# EAGLE design BBB_ADS1271_cape (EAGLE 7.5.0)
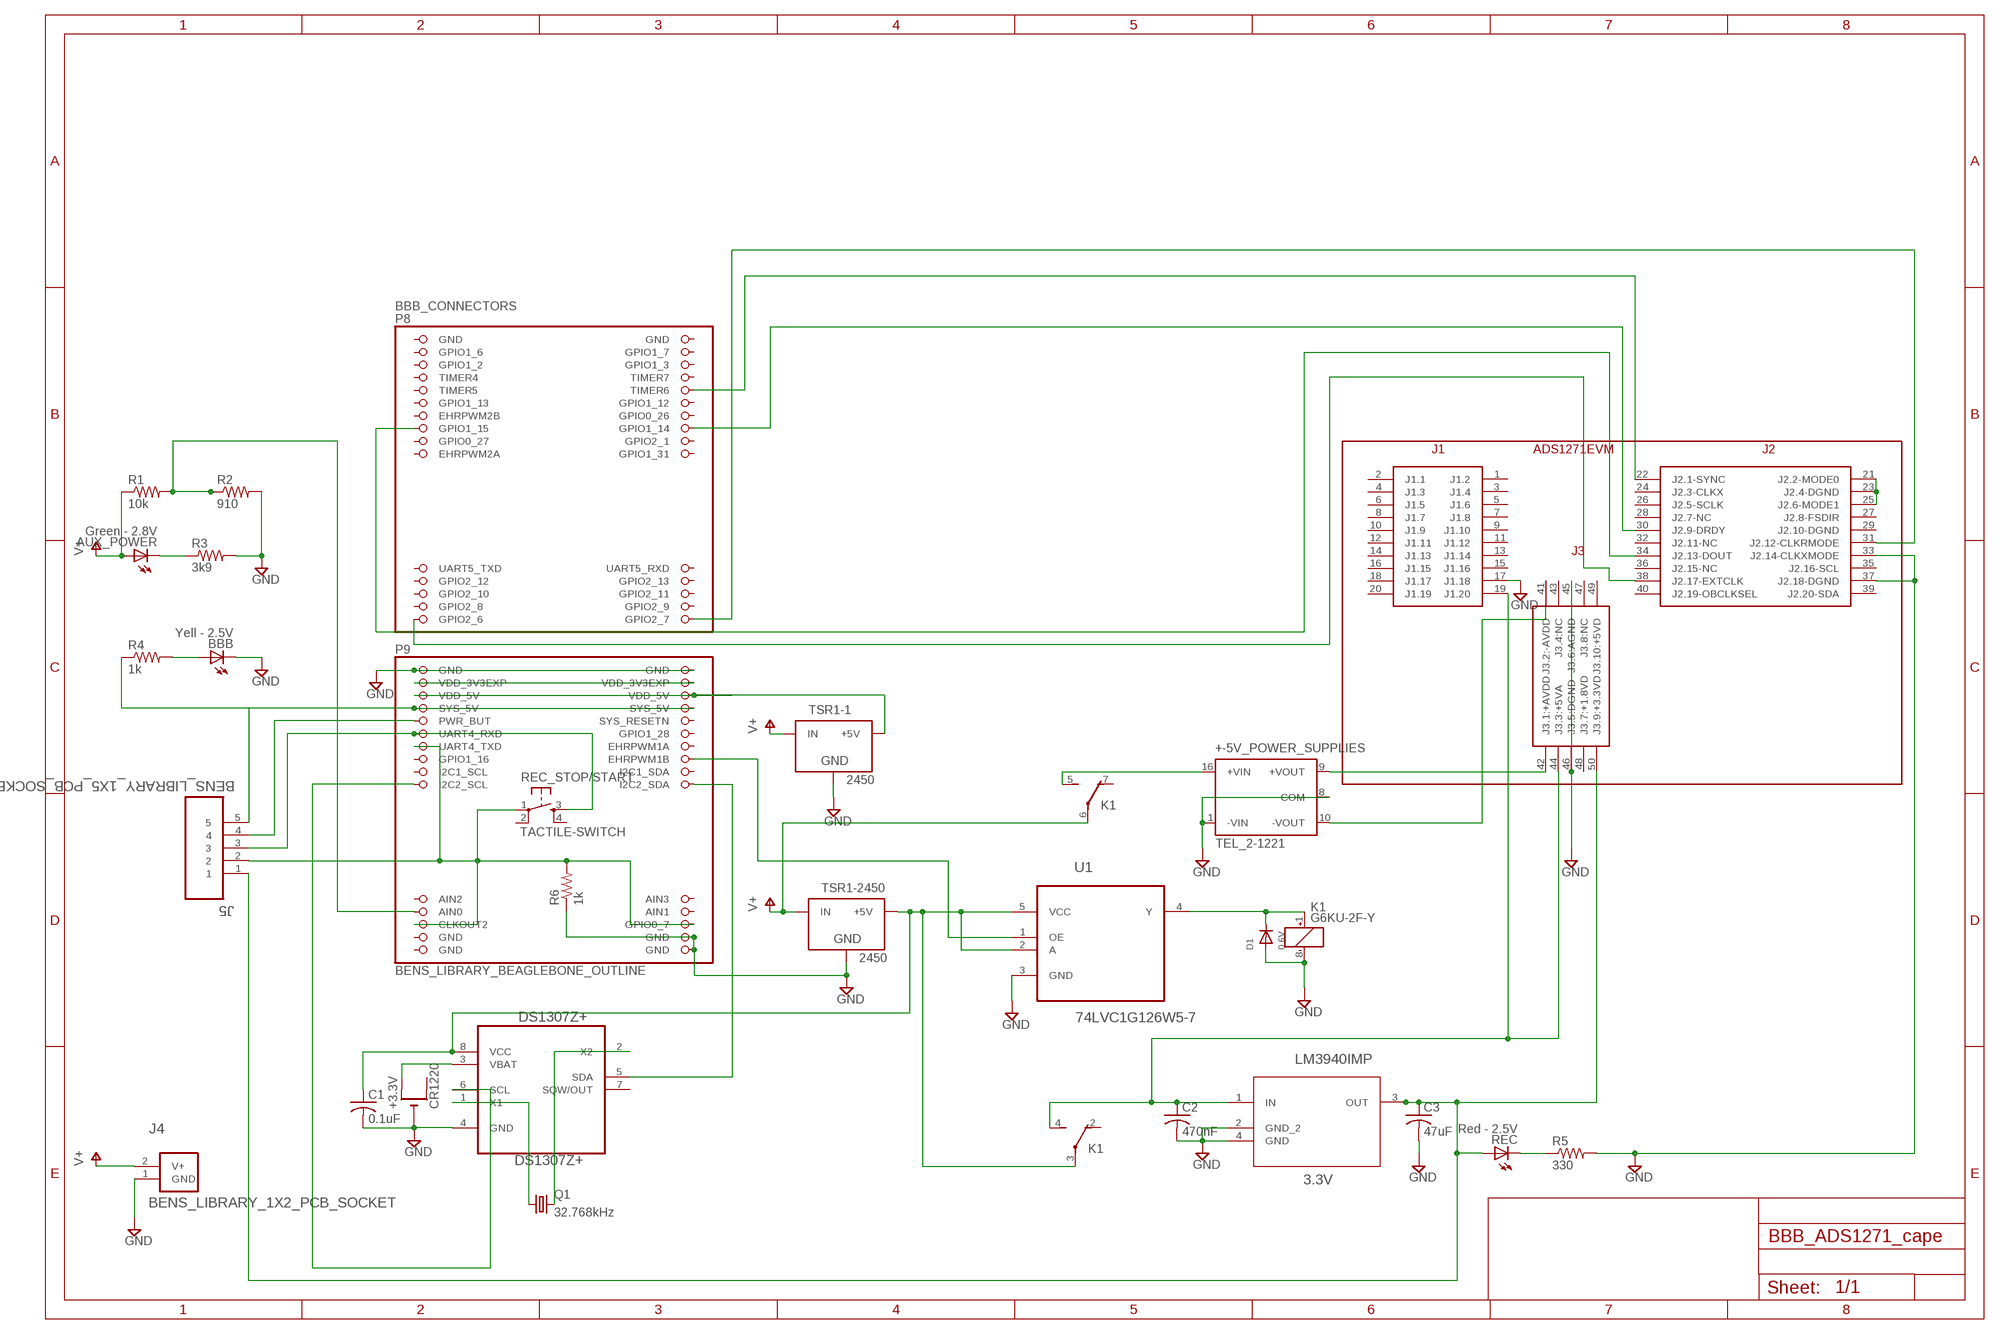
[diagram p0: schematic, sheet 1]

## Parts
+-5V_POWER_SUPPLIES  TEL_2-1221  [TRACOPOWER2W]
ADS1271_CONNECTORS  BENS_LIBRARY_ADS1271EVM  [BENS_LIBRARY_ADS1271EVM]
AUX_POWER  Green - 2.8V  LEDCHIPLED_0805  [CHIPLED_0805]
BBB  Yell - 2.5V  LEDCHIPLED_0805  [CHIPLED_0805]
BBB_CONNECTORS  BENS_LIBRARY_BEAGLEBONE_OUTLINE  [BENS_LIBRARY_BEAGLEBONE_SHIELD]
C1  0.1uF  C-USC0805K  [C0805K]
C2  470nF  C-USC0805K  [C0805K]
C3  47uF  C-USC0805K  [C0805K]
CR1220  +3.3V  ADAFRUIT_CR1220SMT  [ADAFRUIT_CR1220-SMD]
D1  0.6V  DIODE_SOD-123FL  [SOD-123FL]
DS1307Z+  DS1307Z+  [MAXIM_BY_ELEMENT14_BATCH_1_SOIC127P600X175-8N]
J4  BENS_LIBRARY_1X2_PCB_SOCKET  [BENS_LIBRARY_1X2_PCB_SOCKET]
J5  BENS_LIBRARY_1X5_PCB_SOCKET  [BENS_LIBRARY_SAMTEC_SSM-15-L-DV-BE]
K1  G6KU-2F-Y  [G6KU-2F-Y]
LM3940IMP  3.3V  LM3940IMP  [NSC_BY_ELEMENT14_BATCH_1.1_SOT230P696X180-4N]
Q1  32.768kHz  CRYSTALTC38H  [TC38H]
R1  10k  ADAFRUIT_R-US_R0805  [ADAFRUIT_R0805]
R2  910  ADAFRUIT_R-US_R0805  [ADAFRUIT_R0805]
R3  3k9  ADAFRUIT_R-US_R0805  [ADAFRUIT_R0805]
R4  1k  ADAFRUIT_R-US_R0805  [ADAFRUIT_R0805]
R5  330  ADAFRUIT_R-US_R0805  [ADAFRUIT_R0805]
R6  1k  ADAFRUIT_R-US_R0805  [ADAFRUIT_R0805]
REC  Red - 2.5V  LEDCHIPLED_0805  [CHIPLED_0805]
REC_STOP/START  TACTILE-SWITCH  [7914G-6MM]
TSR1-1  2450  TSR1-2450  [STEELCAVEROBOTICS-POWER_TSR-1]
TSR1-2450  2450  TSR1-2450  [STEELCAVEROBOTICS-POWER_TSR-1]
U1  74LVC1G126W5-7  [SOT95P280X145-5N]

## Nets
3.3V_BBB_1: BBB_CONNECTORS.57(UART4_RXD) J5.3 REC_STOP/START.3
3.3V_BBB_2: ADS1271_CONNECTORS.31(J2.12-CLKRMODE) BBB_CONNECTORS.46(GPIO2_7)
3.3V_RELAY: ADS1271_CONNECTORS.50(J3.9:+3.3VD) C3.1 J5.1 LM3940IMP.3(OUT) REC.A
5V: C1.1 DS1307Z+.8(VCC) K1.3(2:P) TSR1-2450.3(+5V) U1.2(A) U1.5(VCC)
5V_BBB: BBB_CONNECTORS.51(VDD_5V) BBB_CONNECTORS.52(VDD_5V) TSR1-1.3(+5V)
5V_RELAY: ADS1271_CONNECTORS.19(J1.20) ADS1271_CONNECTORS.44(J3.3:+5VA) C2.1 K1.4(2:S) LM3940IMP.1(IN)
+5V_OP_AMP: +-5V_POWER_SUPPLIES.9(+VOUT) ADS1271_CONNECTORS.42(J3.1:+AVDD)
-5V_OP_AMP: +-5V_POWER_SUPPLIES.10(-VOUT) ADS1271_CONNECTORS.41(J3.2:-AVDD)
CLK: ADS1271_CONNECTORS.38(J2.17-EXTCLK) BBB_CONNECTORS.45(GPIO2_6)
DGND: ADS1271_CONNECTORS.21(J2.2-MODE0) ADS1271_CONNECTORS.23(J2.4-DGND) ADS1271_CONNECTORS.25(J2.6-MODE1)
DOUT: ADS1271_CONNECTORS.34(J2.13-DOUT) BBB_CONNECTORS.15(GPIO1_15)
DRDY: ADS1271_CONNECTORS.30(J2.9-DRDY) BBB_CONNECTORS.16(GPIO1_14)
GND: +-5V_POWER_SUPPLIES.1(-VIN) +-5V_POWER_SUPPLIES.8(COM) ADS1271_CONNECTORS.17(J1.18) ADS1271_CONNECTORS.33(J2.14-CLKXMODE) ADS1271_CONNECTORS.37(J2.18-DGND) ADS1271_CONNECTORS.45(J3.6:AGND) ADS1271_CONNECTORS.46(J3.5:DGND) BBB.C BBB_CONNECTORS.47(GND) BBB_CONNECTORS.48(GND) BBB_CONNECTORS.90(GND) BBB_CONNECTORS.92(GND) C1.2 C2.2 C3.2 CR1220.- D1.A DS1307Z+.4(GND) J4.1(GND) K1.8(1:-) LM3940IMP.2(GND_2) LM3940IMP.4(GND) R2.2 R3.2 R5.2 R6.1 TSR1-1.2(GND) TSR1-2450.2(GND) U1.3(GND)
N$1: CR1220.+$2(+1) DS1307Z+.3(VBAT)
N$2: +-5V_POWER_SUPPLIES.16(+VIN) K1.5(3:S)
N$8: BBB_CONNECTORS.85(AIN0) R1.2 R2.1
N$10: BBB_CONNECTORS.66(I2C2_SDA) DS1307Z+.5(SDA)
N$11: BBB_CONNECTORS.65(I2C2_SCL) DS1307Z+.6(SCL)
N$12: DS1307Z+.2(X2) Q1.2
N$13: DS1307Z+.1(X1) Q1.1
N$15: AUX_POWER.C R3.1
N$16: D1.C K1.1(1:+) U1.4(Y)
N$18: R5.1 REC.C
N$19: BBB.A R4.2
P8.9: BBB_CONNECTORS.62(EHRPWM1B) U1.1(OE)
PWR_BUT: BBB_CONNECTORS.55(PWR_BUT) J5.4
REC_SWITCH: BBB_CONNECTORS.59(UART4_TXD) BBB_CONNECTORS.87(CLKOUT2) BBB_CONNECTORS.88(GPIO0_7) J5.2 R6.2 REC_STOP/START.1
SYNC: ADS1271_CONNECTORS.22(J2.1-SYNC) BBB_CONNECTORS.10(TIMER6)
SYS_5V: BBB_CONNECTORS.53(SYS_5V) BBB_CONNECTORS.54(SYS_5V) J5.5 R4.1
V+: AUX_POWER.A J4.2(V+) K1.6(3:P) R1.1 TSR1-1.1(IN) TSR1-2450.1(IN)
VDD_3V3EXP: BBB_CONNECTORS.49(VDD_3V3EXP) BBB_CONNECTORS.50(VDD_3V3EXP)
Unconnected: ADS1271_CONNECTORS.1(J1.2) ADS1271_CONNECTORS.2(J1.1) ADS1271_CONNECTORS.3(J1.4) ADS1271_CONNECTORS.4(J1.3) ADS1271_CONNECTORS.5(J1.6) ADS1271_CONNECTORS.6(J1.5) ADS1271_CONNECTORS.7(J1.8) ADS1271_CONNECTORS.8(J1.7) ADS1271_CONNECTORS.9(J1.10) ADS1271_CONNECTORS.10(J1.9) ADS1271_CONNECTORS.11(J1.12) ADS1271_CONNECTORS.12(J1.11) ADS1271_CONNECTORS.13(J1.14) ADS1271_CONNECTORS.14(J1.13) ADS1271_CONNECTORS.15(J1.16) ADS1271_CONNECTORS.16(J1.15) ADS1271_CONNECTORS.18(J1.17) ADS1271_CONNECTORS.20(J1.19) ADS1271_CONNECTORS.24(J2.3-CLKX) ADS1271_CONNECTORS.26(J2.5-SCLK) ADS1271_CONNECTORS.27(J2.8-FSDIR) ADS1271_CONNECTORS.28(J2.7-NC) ADS1271_CONNECTORS.29(J2.10-DGND) ADS1271_CONNECTORS.32(J2.11-NC) ADS1271_CONNECTORS.35(J2.16-SCL) ADS1271_CONNECTORS.36(J2.15-NC) ADS1271_CONNECTORS.39(J2.20-SDA) ADS1271_CONNECTORS.40(J2.19-OBCLKSEL) ADS1271_CONNECTORS.43(J3.4:NC) ADS1271_CONNECTORS.47(J3.8:NC) ADS1271_CONNECTORS.48(J3.7:+1.8VD) ADS1271_CONNECTORS.49(J3.10:+5VD) BBB_CONNECTORS.1(GND) BBB_CONNECTORS.2(GND) BBB_CONNECTORS.3(GPIO1_6) BBB_CONNECTORS.4(GPIO1_7) BBB_CONNECTORS.5(GPIO1_2) BBB_CONNECTORS.6(GPIO1_3) BBB_CONNECTORS.7(TIMER4) BBB_CONNECTORS.8(TIMER7) BBB_CONNECTORS.9(TIMER5) BBB_CONNECTORS.11(GPIO1_13) BBB_CONNECTORS.12(GPIO1_12) BBB_CONNECTORS.13(EHRPWM2B) BBB_CONNECTORS.14(GPIO0_26) BBB_CONNECTORS.17(GPIO0_27) BBB_CONNECTORS.18(GPIO2_1) BBB_CONNECTORS.19(EHRPWM2A) BBB_CONNECTORS.20(GPIO1_31) BBB_CONNECTORS.37(UART5_TXD) BBB_CONNECTORS.38(UART5_RXD) BBB_CONNECTORS.39(GPIO2_12) BBB_CONNECTORS.40(GPIO2_13) BBB_CONNECTORS.41(GPIO2_10) BBB_CONNECTORS.42(GPIO2_11) BBB_CONNECTORS.43(GPIO2_8) BBB_CONNECTORS.44(GPIO2_9) BBB_CONNECTORS.56(SYS_RESETN) BBB_CONNECTORS.58(GPIO1_28) BBB_CONNECTORS.60(EHRPWM1A) BBB_CONNECTORS.61(GPIO1_16) BBB_CONNECTORS.63(I2C1_SCL) BBB_CONNECTORS.64(I2C1_SDA) BBB_CONNECTORS.83(AIN2) BBB_CONNECTORS.84(AIN3) BBB_CONNECTORS.86(AIN1) CR1220.+$1(+) DS1307Z+.7(SQW/OUT) K1.2(2:O) K1.7(3:O) REC_STOP/START.2 REC_STOP/START.4

## Power pins joined to a net without a drawn wire
GND: BBB_CONNECTORS.89(GND) BBB_CONNECTORS.91(GND)

## Library data of the parts
+-5V_POWER_SUPPLIES = BBB_ADS1271_cape:TEL_2-: DC/DC-Konverter 2 Watt, 1 x Input, 1 x +- Output Source: http://www.tracopower.com/datasheet_g/tel2-d.pdf; MPN: TEL 2-1221; OC_FARNELL: 1007032; OC_NEWARK: 51R4760
ADS1271_CONNECTORS = BBB_ADS1271_cape:BENS_LIBRARY_ADS1271EVM
AUX_POWER BBB REC = adafruit:LED: LED OSRAM: - CHIPLED LG R971, LG N971, LY N971, LG Q971, LY Q971, LO R971, LY R971 LH N974, LH R974 LS Q976, LO Q976, LY Q976 LO Q996 - Hyper CHIPLED LW Q18S LB Q993, LB Q99A, LB R99A - SideLED LS A670, LO A670, LY A670, LG A670, LP A670 LB A673, LV A673, LT A673, LW A673 LH A674 LY A675 LS A676, LA A676, LO A676, LY A676, LW A676 LS A679, LY A679, LG A679 - Hyper Micro SIDELED® LS Y876, LA Y876, LO Y876, LY Y876 LT Y87S - SmartLED LW L88C, LW L88S LB L89C, LB L89S, LG L890 LS L89K, LO L89K, LY L89K LS L896, LA L896, LO L896, LY L896 - TOPLED LS T670, LO T670, LY T670, LG T670, LP T670 LSG T670, LSP T670, LSY T670, LOP T670, LYG T670 LG T671, LOG T671, LSG T671 LB T673, LV T673, LT T673, LW T673 LH T674 LS T676, LA T676, LO T676, LY T676, LB T676, LH T676, LSB T676, LW T676 LB T67C, LV T67C, LT T67C, LS T67K, LO T67K, LY T67K, LW E67C LS E67B, LA E67B, LO E67B, LY E67B, LB E67C, LV E67C, LT E67C LW T67C LS T679, LY T679, LG T679 LS T770, LO T770, LY T770, LG T770, LP T770 LB T773, LV T773, LT T773, LW T773 LH T774 LS E675, LA E675, LY E675, LS T675 LS T776, LA T776, LO T776, LY T776, LB T776 LHGB T686 LT T68C, LB T68C - Hyper Mini TOPLED® LB M676 - Mini TOPLED Santana® LG M470 LS M47K, LO M47K, LY M47K Source: http://www.osram.convergy.de/
BBB_CONNECTORS = BBB_ADS1271_cape:BENS_LIBRARY_BEAGLEBONE_OUTLINE: Should match A3 pinout - but not completely tested
C1-C3 = adafruit:C-US: CAPACITOR, American symbol
CR1220 = BBB_ADS1271_cape:ADAFRUIT_CR1220: CR1216/CR1220/CR1225 12mm 3V lithium coin cell Great for battery packup. Both SMT and THM holders. Note the THM package has the ground pads on both sides of the PCB so that the masks are the same - this reduces the cost
D1 = BBB_ADS1271_cape:DIODE: Diode SMADIODE - SMA Surface Mount Package 20V 1A Schottky Diode Digikey: 641-1014-6-ND DO-1N4148 - Through Hole Small Current Diode SOD-123 20V 1 A (.5mV Vf) Schottky Diode - Digikey: MBRX120TPMSCT-ND SOD-323 10V 570mA (.38mV Vf, 3ns) Schottky Diode - Digikey: ZLLS410CT-ND SOD-523 30V 30mA Schottky Diode (RB751S-40TE61) - Digikey: RB751S-40TE61CT-ND SOT23-R/W - SOT23 Package (R = Solder Paste/Reflow Ovens, W = Hand-Soldering) BAT54Film 40V 300mA - Digikey: 497-7162-1-ND
DS1307Z+ = BBB_ADS1271_cape:DS1307Z+: 64 x 8, Serial, I2C Real-Time Clock; MPN: DS1307Z+; OC_FARNELL: 9726322; OC_NEWARK: 08J6234; PACKAGE: SOIC-8; SUPPLIER: Maxim
J4 = BBB_ADS1271_cape:BENS_LIBRARY_1X2_PCB_SOCKET: CONN SOCKET, 2.54MM, SMT, 1X5WAY
J5 = BBB_ADS1271_cape:BENS_LIBRARY_1X5_PCB_SOCKET: CONN SOCKET, 2.54MM, SMT, 1X5WAY
K1 = BBB_ADS1271_cape:G6K: Low Signal Relay oeiwcsnts1.omron.com/.. D20G6K0100.pdf; MF: OMRON COMPONENTS USA; MPN: G6KU-2F-Y DC3; OC_FARNELL: unknown; OC_NEWARK: 89C6496
LM3940IMP = BBB_ADS1271_cape:LM3940IMP: Low Dropout Regulator; MANUFACTURER_PART_NUMBER: LM3940IMP-33; OC_FARNELL: 9779280; OC_NEWARK: 41K5122; PACKAGE: SOT-223-4; SUPPLIER: National Semiconductors
Q1 = crystal:CRYSTAL: CRYSTAL; OC_FARNELL: unknown; OC_NEWARK: unknown
R1-R6 = BBB_ADS1271_cape:ADAFRUIT_R-US_: RESISTOR, American symbol
REC_STOP/START = bens_library:TACTILE-SWITCH: Tactile Switch 4 Pins, SPST NO
TSR1-1 TSR1-2450 = BBB_ADS1271_cape:TSR1-2450: Traco Power TSR 1-2450 5.0v switching regulator
U1 = BBB_ADS1271_cape:74LVC1G126W5-7: SINGLE BUFFER GATE WITH 3-STATE OUTPUT; MPN: 74LVC1G126W5-7; OC_FARNELL: 1893831; OC_NEWARK: 47T3918; PACKAGE: SOT-5; SUPPLIER: DIODES INC.

## Board
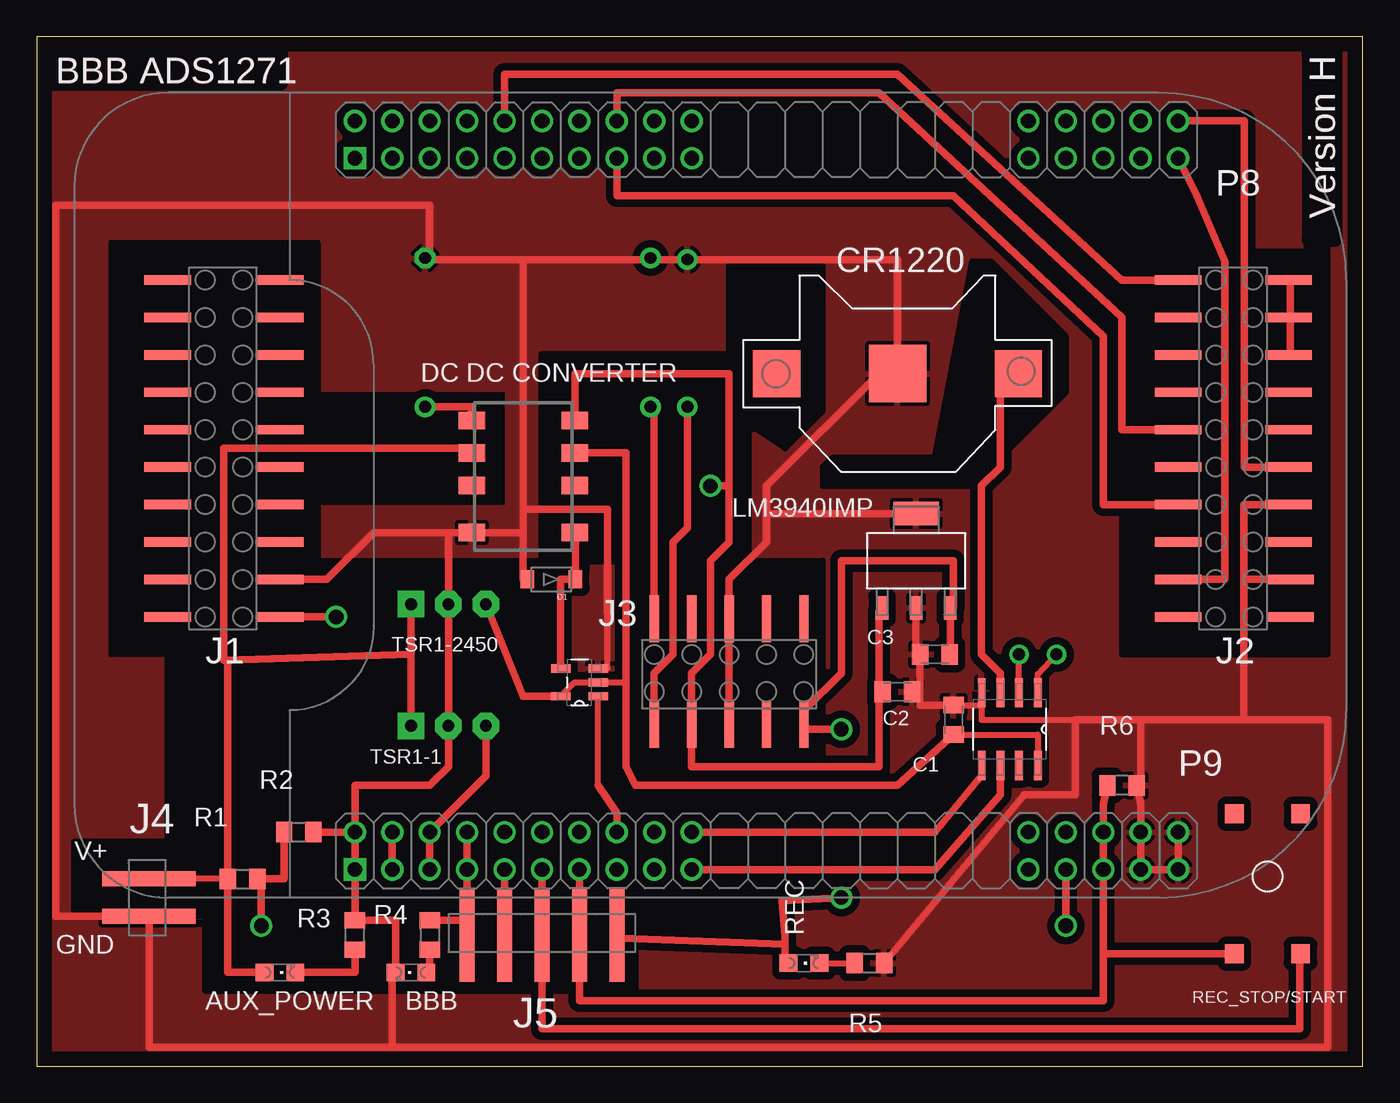
[diagram p1: board, top side]
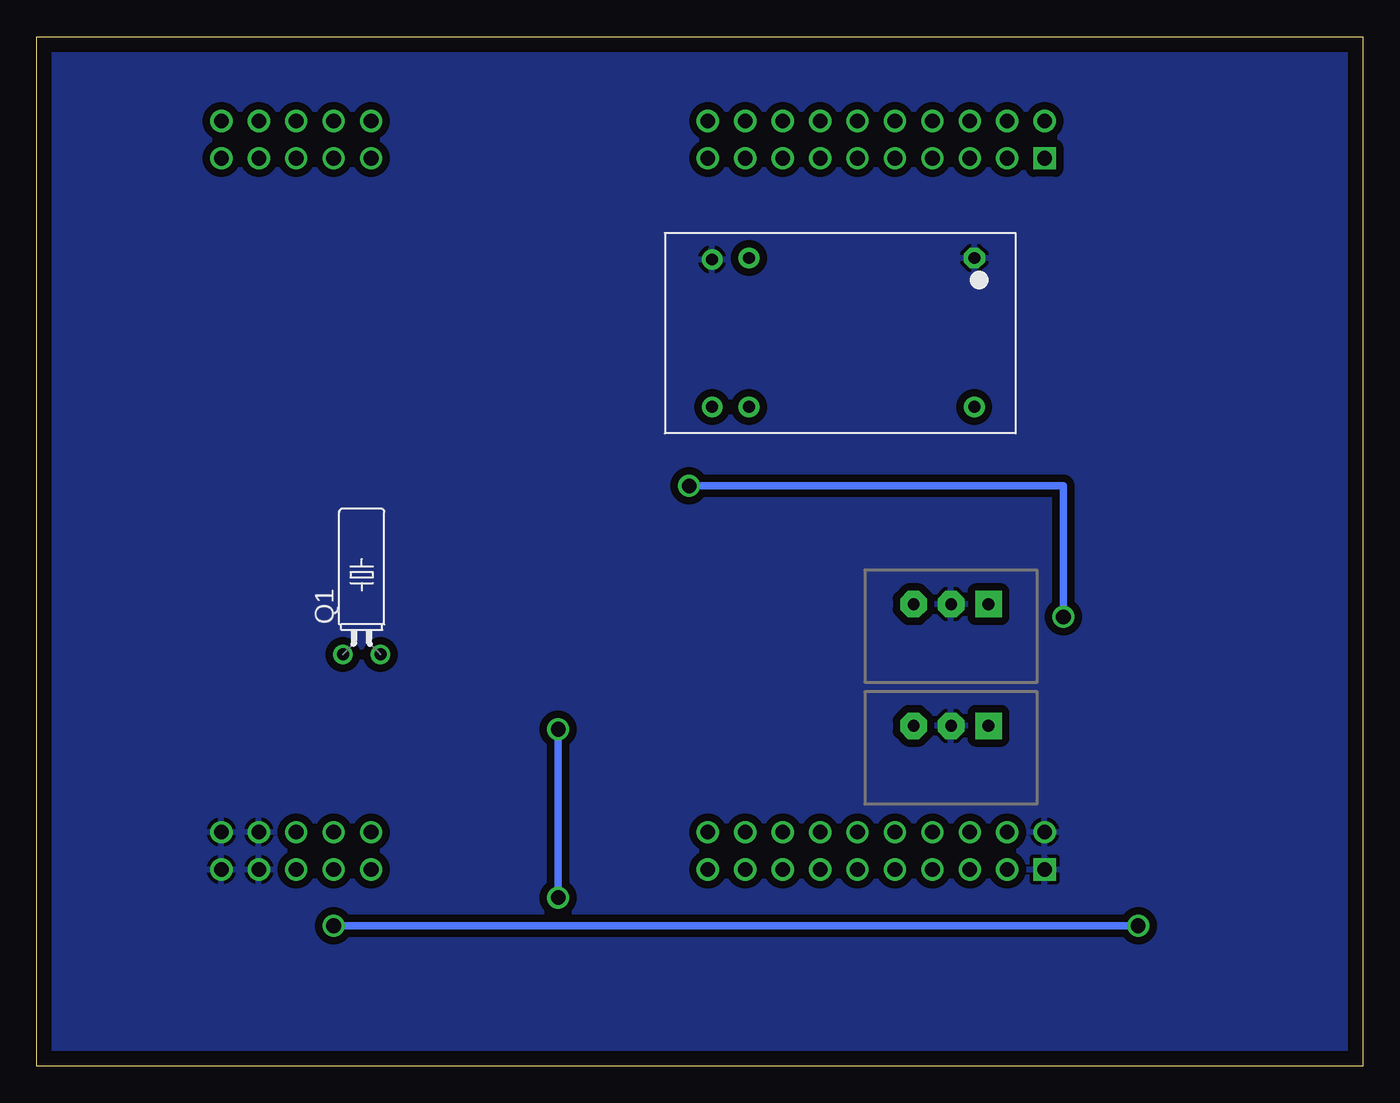
[diagram p2: board, bottom side, seen from below]

Size 90 x 69.84 mm. Coordinates in mm from the lower left corner, seen from the top.
Outline: 0,0 90,0 90,69.84 0,69.84 0,0
Copper layers (1*16): Top 0.035mm / dielectric 1.5mm / Bottom 0.035mm
Design rules "pcb_design_rules": minimum track width 10mil, minimum drill 24mil, track to track 20mil, track to pad 20mil, pad to pad 8mil, via to via 20mil, smd to smd 8mil, copper to edge 40mil, drill to drill 8mil, minimum pad ring 10mil, minimum via ring 8mil, stop-mask expansion 4mil, vias tented up to drill 0mil, thermal gap 10mil
tRestrict: area 5.1,27.9 to 19.1,55.9; area 73.7,27.9 to 87.6,55.2; area 40.6,20.3 to 53.3,34.3; area 47,41.9 to 53.3,54.6; area 61,39.4 to 69.8,54.6; area 53.3,39.4 to 63.5,41.3; area 11.4,5.1 to 40.6,16.5; area 2.5,10.2 to 15.2,15.2; area 8.9,15.2 to 35.6,34.3; area 63.5,21.6 to 68.6,25.4; area 34.9,22.9 to 38.7,26.7; area 19,38.1 to 31.8,45.7; 1 more areas

### Footprints (pad centres in the part's own frame; a part is rotated, then mirrored left to right if it is on the bottom)
TRACOPOWER2W = drill 0.8 pad 1.4 octagon: 1 -9.2,-5.3 | drill 0.8 pad 1.4: 7 6.1,-5.3; 8 8.6,-5.2; 9 8.6,4.8; 10 6.1,4.8; 16 -9.2,4.8
BENS_LIBRARY_ADS1271EVM = smd 3.175 x 0.635: 1 7.62,30.48; 2 0,30.48; 3 7.62,27.94; 4 0,27.94; 5 7.62,25.4; 6 0,25.4; 7 7.62,22.86; 8 0,22.86; 9 7.62,20.32; 10 0,20.32; 11 7.62,17.78; 12 0,17.78; 13 7.62,15.24; 14 0,15.24; 15 7.62,12.7; 16 0,12.7; 17 7.62,10.16; 18 0,10.16; 19 7.62,7.62; 20 0,7.62; 21 76.073,30.48; 22 68.58,30.48; 23 76.073,27.94; 24 68.58,27.94; 25 76.073,25.4; 26 68.58,25.4; 27 76.073,22.86; 28 68.58,22.86; 29 76.073,20.32; 30 68.58,20.32; 31 76.073,17.78; 32 68.58,17.78; 33 76.073,15.24; 34 68.58,15.24; 35 76.073,12.7; 36 68.58,12.7; 37 76.2,10.16; 38 68.58,10.16; 39 76.2,7.62; 40 68.58,7.62 | smd 0.635 x 3.175: 41 33.02,7.493; 42 33.02,0.318; 43 35.56,7.493; 44 35.56,0.318; 45 38.1,7.493; 46 38.1,0.318; 47 40.64,7.493; 48 40.64,0.318; 49 43.18,7.493; 50 43.18,0.318
CHIPLED_0805 = smd 1.2 x 1.2: A 0,-1.05; C 0,1.05
BENS_LIBRARY_BEAGLEBONE_SHIELD = drill 1 square: 1 4.445,19.05; 47 52.705,19.05 | drill 1: 2 1.905,19.05; 3 4.445,21.59; 4 1.905,21.59; 5 4.445,24.13; 6 1.905,24.13; 7 4.445,26.67; 8 1.905,26.67; 9 4.445,29.21; 10 1.905,29.21; 11 4.445,31.75; 12 1.905,31.75; 13 4.445,34.29; 14 1.905,34.29; 15 4.445,36.83; 16 1.905,36.83; 17 4.445,39.37; 18 1.905,39.37; 19 4.445,41.91; 20 1.905,41.91; 37 4.445,64.77; 38 1.905,64.77; 39 4.445,67.31; 40 1.905,67.31; 41 4.445,69.85; 42 1.905,69.85; 43 4.445,72.39; 44 1.905,72.39; 45 4.445,74.93; 46 1.905,74.93; 48 50.165,19.05; 49 52.705,21.59; 50 50.165,21.59; 51 52.705,24.13; 52 50.165,24.13; 53 52.705,26.67; 54 50.165,26.67; 55 52.705,29.21; 56 50.165,29.21; 57 52.705,31.75; 58 50.165,31.75; 59 52.705,34.29; 60 50.165,34.29; 61 52.705,36.83; 62 50.165,36.83; 63 52.705,39.37; 64 50.165,39.37; 65 52.705,41.91; 66 50.165,41.91; 83 52.705,64.77; 84 50.165,64.77; 85 52.705,67.31; 86 50.165,67.31; 87 52.705,69.85; 88 50.165,69.85; 89 52.705,72.39; 90 50.165,72.39; 91 52.705,74.93; 92 50.165,74.93
C0805K = smd 1.1 x 1.4: 1 -1,0; 2 1,0
ADAFRUIT_CR1220-SMD = smd 3.2 x 3.2: +$1 -8.2,0; +$2 8.2,0 | smd 3.9 x 3.9: - 0,0
SOD-123FL = smd 0.91 x 1.22: A 1.637,0; C -1.637,0
MAXIM_BY_ELEMENT14_BATCH_1_SOIC127P600X175-8N = smd 1.981 x 0.533: 1 -2.464,1.905; 2 -2.464,0.635; 3 -2.464,-0.635; 4 -2.464,-1.905; 5 2.464,-1.905; 6 2.464,-0.635; 7 2.464,0.635; 8 2.464,1.905
BENS_LIBRARY_1X2_PCB_SOCKET = smd 1.016 x 6.35: 1 2.54,0; 2 5.08,0
BENS_LIBRARY_SAMTEC_SSM-15-L-DV-BE = smd 1.016 x 6.35: 1 12.7,0; 2 10.16,0; 3 7.62,0; 4 5.08,0; 5 2.54,0
G6KU-2F-Y = smd 1.2 x 1.8: 1 -3.8,-3.5; 2 -0.6,-3.5; 3 1.6,-3.5; 4 3.8,-3.5; 5 3.8,3.5; 6 1.6,3.5; 7 -0.6,3.5; 8 -3.8,3.5
NSC_BY_ELEMENT14_BATCH_1.1_SOT230P696X180-4N = smd 1.6 x 0.838: 1 -3.2,2.311; 2 -3.2,0; 3 -3.2,-2.311 | smd 1.6 x 3.099: 4 3.2,0
TC38H = drill 0.813: 1 -1.27,0; 2 1.27,0
ADAFRUIT_R0805 = smd 1.1 x 1.4: 1 -1,0; 2 1,0
7914G-6MM = smd 1.27 x 1.27: 1 0,0; 2 0,9.5; 3 4.5,0; 4 4.5,9.5
STEELCAVEROBOTICS-POWER_TSR-1 = drill 0.8 pad 1.8 square: 1 -2.54,-1.5 | drill 0.8 pad 1.8 octagon: 2 0,-1.5; 3 2.54,-1.5
SOT95P280X145-5N = smd 1.321 x 0.559: 1 -1.27,0.94; 2 -1.27,0; 3 -1.27,-0.94; 4 1.27,-0.94; 5 1.27,0.94

### Placement (x,y rotation side)
+-5V_POWER_SUPPLIES  35.56,49.53 180 bottom
ADS1271_CONNECTORS  8.89,22.86 0 top
AUX_POWER  16.51,6.35 270 top
BBB  25.4,6.35 90 top
BBB_CONNECTORS  2.54,66.04 270 top
C1  62.23,23.5 90 top
C2  58.42,25.4 0 top
C3  60.96,27.94 180 top
CR1220  58.42,46.99 0 top
D1  34.92,33.02 180 top
DS1307Z+  66.04,22.86 270 top
J4  7.62,7.62 90 top
J5  26.67,8.89 0 top
K1  33.02,40.01 90 top
LM3940IMP  59.69,34.29 90 top
Q1  67.94,27.94 0 bottom
R1  13.97,12.7 0 top
R2  17.78,15.88 0 top
R3  21.59,8.89 90 top
R4  26.67,8.89 270 top
R5  56.52,6.99 0 top
R6  73.66,19.05 180 top
REC  52.07,6.99 270 top
REC_STOP/START  81.28,7.62 0 top
TSR1-1  27.94,21.59 180 bottom
TSR1-2450  27.94,29.84 180 bottom
U1  36.83,26.04 180 top

### Tracks (layer width: path | path; a pad name or v marks a point on that pad's centre or on a via)
3.3V_BBB_1
  Top 0.508: BBB_CONNECTORS.57 J5.3 34.29,2.54 85.72,2.54 85.72,7.62 REC_STOP/START.3
3.3V_BBB_2
  Top 0.508: ADS1271_CONNECTORS.31 81.97,40.64 81.97,64.14 BBB_CONNECTORS.46
3.3V_RELAY  (via drill 1)
  Top 0.508: J5.1 39.59,8.67 50.8,8.26 | C3.1 62,27.94 LM3940IMP.3 62.23,31.09 62.23,34.29 54.61,34.29 54.61,26.67 52.07,24.13 ADS1271_CONNECTORS.50 52.39,22.86 v54.61,22.86 | 50.8,8.26 50.8,6.99 REC.A | v54.61,11.43 50.58,11.21 50.8,8.89 50.8,8.26
  Bottom 0.508: v54.61,22.86 v54.61,11.43
5V
  Top 0.406: C1.1 67.94,22.5 DS1307Z+.8 | 40.01,26.04 U1.2 36.5,26.04 U1.5
  Top 0.508: K1.3 40.01,41.6 40.01,26.04 40.01,20.32 40.64,19.05 58.42,19.05 C1.1 | U1.5 33.02,25.09 TSR1-2450.3
5V_BBB
  Top 0.508: BBB_CONNECTORS.51 BBB_CONNECTORS.52 30.48,19.68 TSR1-1.3
5V_RELAY  (via drill 1)
  Top 0.508: K1.4 36.52,46.99 45.72,46.99 46.99,46.99 46.99,39.37 | 46.99,39.37 46.99,35.56 45.72,34.29 45.72,27.94 44.45,26.67 ADS1271_CONNECTORS.44 44.45,20.32 57.15,20.32 57.15,25.4 | LM3940IMP.1 57.15,30.86 57.15,25.4 | C2.1 57.15,25.4 | ADS1271_CONNECTORS.19 v20.32,30.48 | v45.72,39.37 46.99,39.37
  Bottom 0.508: v20.32,30.48 20.32,39.37 v45.72,39.37
+5V_OP_AMP
  Top 0.508: +-5V_POWER_SUPPLIES.9 44.16,36.54 43.18,35.56 43.18,27.94 41.91,26.67 ADS1271_CONNECTORS.42
-5V_OP_AMP
  Top 0.508: +-5V_POWER_SUPPLIES.10 41.91,44.73 ADS1271_CONNECTORS.41
CLK
  Top 0.508: ADS1271_CONNECTORS.38 80.64,33.02 80.64,54.61 78.74,59.05 BBB_CONNECTORS.45
DGND
  Top 0.508: 85.09,50.8 85.09,48.26 ADS1271_CONNECTORS.25 | ADS1271_CONNECTORS.23 85.09,50.8 | 85.09,50.8 85.09,53.34 ADS1271_CONNECTORS.21
DOUT
  Top 0.508: BBB_CONNECTORS.15 39.37,59.05 62.23,59.05 72.39,49.53 72.39,38.1 ADS1271_CONNECTORS.34 78.74,38.1
DRDY
  Top 0.508: BBB_CONNECTORS.16 39.37,66.04 57.15,66.04 73.66,50.8 73.66,43.18 ADS1271_CONNECTORS.30
GND
  Top 0.406: C1.2 64.14,24.5 | 64.14,24.5 DS1307Z+.4 | 64.14,24.5 64.14,23.5 70.48,23.5 | U1.3 38.74,26.98 38.73,30.77 | 24.13,1.27 24.35,1.27 | 59.96,24.5 59.96,25.4 C2.2
  Top 0.508: BBB_CONNECTORS.48 BBB_CONNECTORS.47 R3.2 24.35,9.89 BBB.C | BBB_CONNECTORS.92 BBB_CONNECTORS.91 BBB_CONNECTORS.89 BBB_CONNECTORS.90 74.93,17.78 R6.1 74.93,19.05 74.93,23.5 | R2.2 BBB_CONNECTORS.48 | 33.02,54.73 +-5V_POWER_SUPPLIES.8 58.42,54.73 CR1220.- 57.15,46.99 49.53,39.37 49.53,37.49 | 33.02,54.73 26.46,54.73 +-5V_POWER_SUPPLIES.1 26.67,54.83 26.67,58.42 1.27,58.42 1.27,10.16 J4.1 7.62,1.27 24.13,1.27 | ADS1271_CONNECTORS.46 ADS1271_CONNECTORS.45 46.99,33.02 49.53,35.56 49.53,37.49 | 49.53,37.49 LM3940IMP.4 | LM3940IMP.2 59.69,27.94 C3.2 59.96,24.5 C1.2 | 74.93,23.5 70.48,23.5 70.48,18.41 67.04,18.41 R5.2 | K1.8 33.02,36.2 | 33.02,36.2 33.02,37.78 | 33.02,37.78 33.02,54.73 | 32.7,36.2 K1.8 | ADS1271_CONNECTORS.33 81.92,38.1 81.92,33.02 | 24.13,1.27 87.63,1.27 87.63,23.5 81.92,23.5 | ADS1271_CONNECTORS.37 81.92,33.02 | 81.92,33.02 81.92,23.5 | 81.92,23.5 74.93,23.5 | 38.73,30.77 38.73,37.78 33.02,37.78 | K1.8 27.94,36.2 TSR1-2450.2 TSR1-1.2 27.94,20.32 26.67,19.05 21.59,19.05 BBB_CONNECTORS.48 | ADS1271_CONNECTORS.17 19.68,33.02 22.86,36.2 29.51,36.2 K1.8 | 24.13,6.35 24.13,1.27 | D1.A 33.02,33.02 33.02,36.2
  pour Top: -3.81,-2.54 -3.81,73.66 93.98,73.66 93.98,-2.54
  pour Bottom: -2.54,74.93 91.44,74.93 91.44,-1.27 -2.54,-1.27
N$1
  Top 0.508: DS1307Z+.3 65.41,26.67 64.14,27.94 64.14,39.37 65.41,40.64 65.41,46.99 CR1220.+$2
N$2
  Top 0.508: +-5V_POWER_SUPPLIES.16 29.52,44.73 K1.5
N$8  (via drill 1)
  Top 0.508: R2.1 16.78,12.7 R1.2 15.24,12.7 v15.24,9.53 | v69.85,9.53 BBB_CONNECTORS.85
  Bottom 0.508: v69.85,9.53 v15.24,9.53
N$10
  Top 0.508: DS1307Z+.5 64.14,19.68 60.96,15.88 BBB_CONNECTORS.66
N$11
  Top 0.508: DS1307Z+.6 65.41,18.41 60.96,13.34 BBB_CONNECTORS.65
N$12
  Top 0.406: DS1307Z+.2 Q1.2
N$13
  Top 0.406: DS1307Z+.1 67.94,26.59 Q1.1
N$15
  Top 0.508: R3.1 21.59,6.35 AUX_POWER.C
N$16
  Top 0.508: K1.1 36.56,36.2 D1.C 35.56,33.02 U1.4
N$18
  Top 0.406: REC.C R5.1
N$19
  Top 0.508: BBB.A 26.67,6.35 R4.2
P8.9
  Top 0.406: 38.1,19.05 U1.1
  Top 0.508: BBB_CONNECTORS.62 39.37,17.14 38.1,19.05
PWR_BUT
  Top 0.508: BBB_CONNECTORS.55 J5.4
REC_SWITCH
  Top 0.508: R6.2 72.39,17.78 BBB_CONNECTORS.88 BBB_CONNECTORS.87 72.39,7.62 | REC_STOP/START.1 72.39,7.62 | 72.39,7.62 72.39,4.45 36.83,4.45 J5.2 BBB_CONNECTORS.59
SYNC
  Top 0.508: BBB_CONNECTORS.10 31.75,67.31 58.42,67.31 73.66,53.34 ADS1271_CONNECTORS.22
SYS_5V
  Top 0.508: BBB_CONNECTORS.54 BBB_CONNECTORS.53 29.21,9.89 | 29.21,9.89 J5.5 | R4.1 29.21,9.89
V+
  Top 0.406: R1.1 J4.2
  Top 0.508: R1.1 12.97,21.36 | R1.1 12.97,6.35 AUX_POWER.A | 25.4,27.94 12.97,27.54 R1.1 | TSR1-2450.1 25.4,27.94 | 25.4,27.94 12.7,27.54 12.7,41.91 29.52,41.91 K1.6 | TSR1-1.1 25.4,27.94
VDD_3V3EXP
  Top 0.508: BBB_CONNECTORS.50 BBB_CONNECTORS.49

### Text on the board
Top: Version H | BBB ADS1271
tNames: Version H | BBB ADS1271 | P8 | J3 | J1 | J2 | P9 | V+ | GND
tRestrict: Version H | BBB ADS1271